# EAGLE schematic CNC Power V2 (EAGLE 7.6.0)
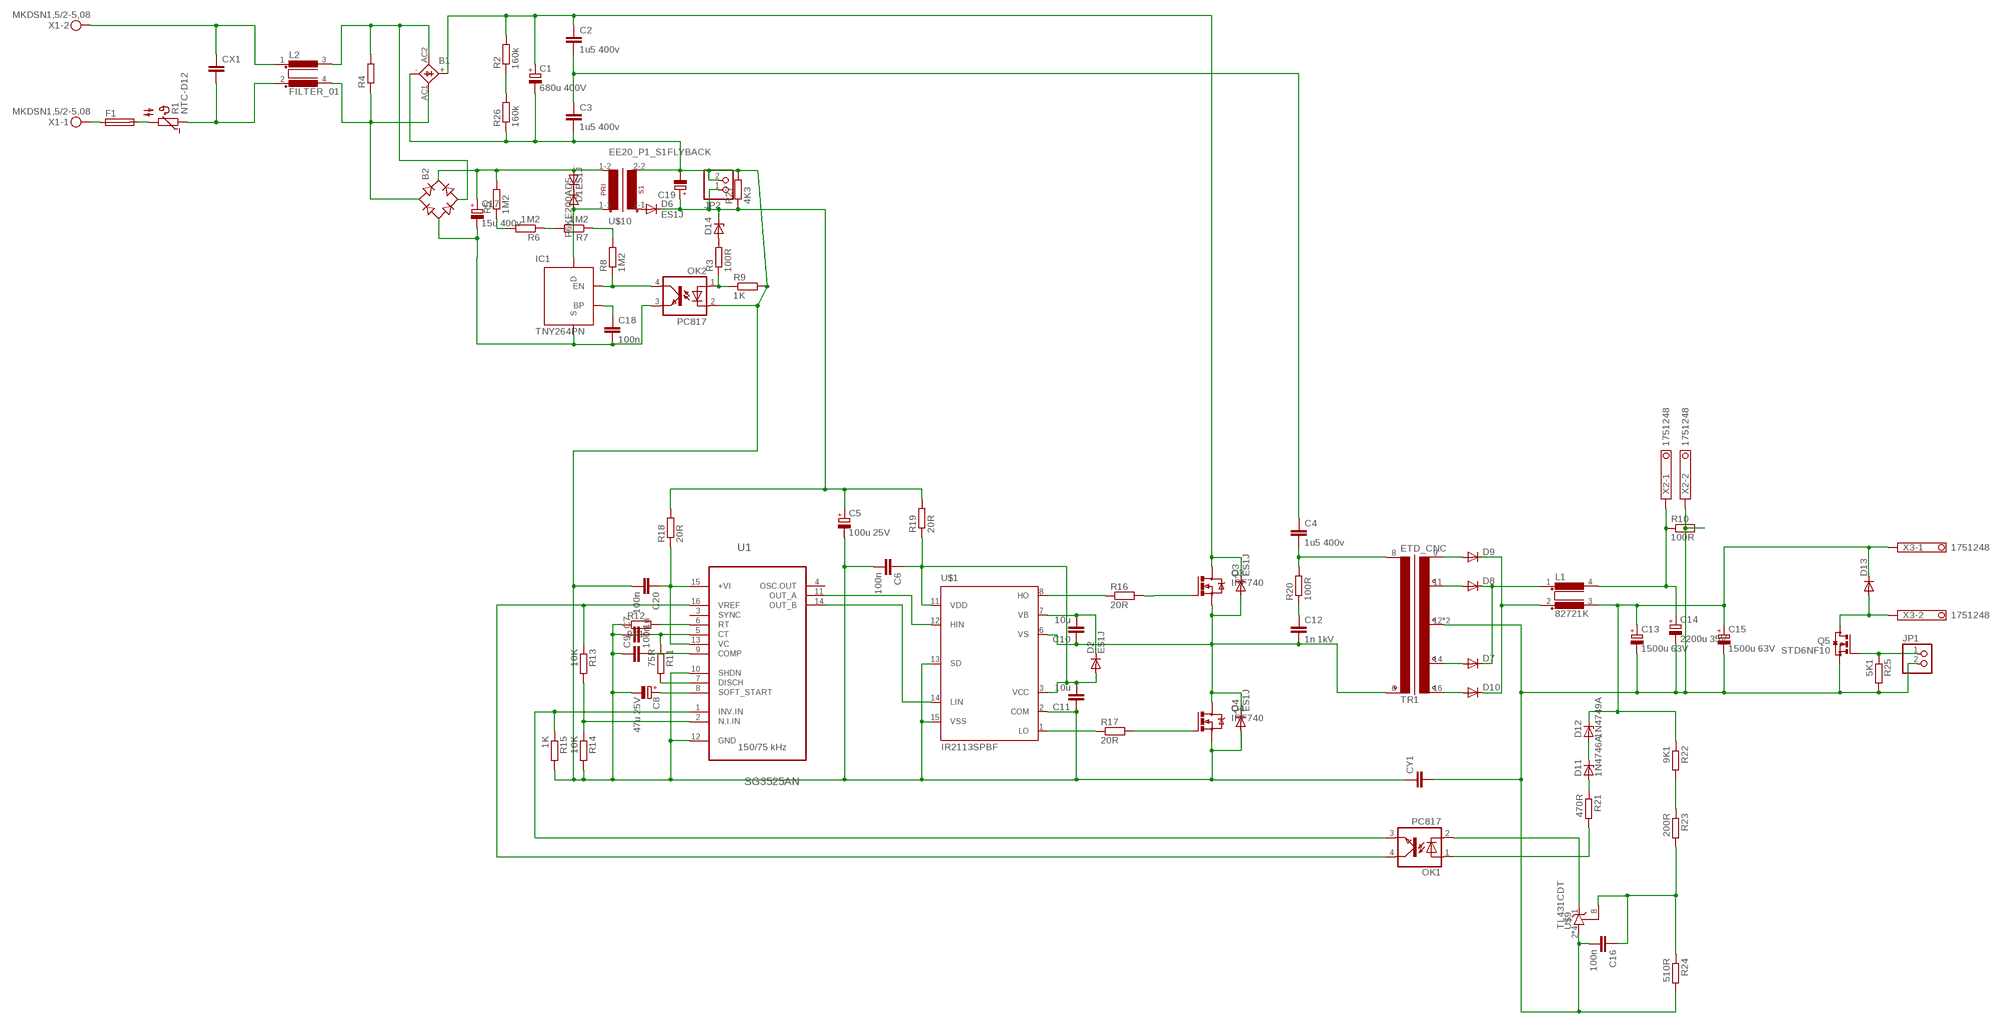
[diagram p0: schematic, sheet 1]

## Parts
B1  KBL  [KBL]
B2  RB1A  [RB1A]
C1  680u 400V  CPOL-EUE10-35  [EB35D]
C2  1u5 400v  C-EU225-074X268  [C225-074X268]
C3  1u5 400v  C-EU225-074X268  [C225-074X268]
C4  1u5 400v  C-EU225-074X268  [C225-074X268]
C5  100u 25V  CPOL-EUE2.5-7  [E2,5-7]
C6  100n  C-EUC0805  [C0805]
C7  1n  C-EUC0805  [C0805]
C8  47u 25V  CPOL-EUE2.5-7  [E2,5-7]
C9  100n  C-EUC0805  [C0805]
C10  10u  C-EUC0805  [C0805]
C11  10u  C-EUC0805  [C0805]
C12  1n 1kV  C-EU050-025X075  [C050-025X075]
C13  1500u 63V  CPOL-EUE7.5-18  [E7,5-18]
C14  2200u 35V  CPOL-EUE7.5-18  [E7,5-18]
C15  1500u 63V  CPOL-EUE7.5-18  [E7,5-18]
C16  100n  C-EUC0805  [C0805]
C17  15u 400v  CPOL-EUE5-13  [E5-13]
C18  100n  C-EUC0805  [C0805]
C19  CPOL-EUE2.5-7  [E2,5-7]
C20  100n  C-EUC0805  [C0805]
CX1  CXXC15B8  [XC15B8]
CY1  CYYC10B4  [YC10B4]
D1  P6KE200A  DIODE-DO204-10  [DO204-10]
D2  ES1J  DIODE-DO214AC  [DO214AC]
D3  ES1J  DIODE-DO214AC  [DO214AC]
D4  ES1J  DIODE-DO214AC  [DO214AC]
D5  ES1J  DIODE-DO214AC  [DO214AC]
D6  ES1J  DIODE-DO214AC  [DO214AC]
D7  DIODE-DO220S  [DO220S]
D8  DIODE-DO220S  [DO220S]
D9  DIODE-DO220S  [DO220S]
D10  DIODE-DO220S  [DO220S]
D11  1N4746A  ZENER-DIODEDO41Z10  [DO41Z10]
D12  1N4749A  ZENER-DIODEDO41Z10  [DO41Z10]
D13  DIODE-DO220S  [DO220S]
D14  ZENER-DIODEDO41Z10  [DO41Z10]
F1  SH22,5  [SH22,5]
IC1  TNY264PN  [DIP-8B]
JP1  PINHD-1X2  [1X02]
JP2  PINHD-1X2  [1X02]
L1  82721K  [82721K]
L2  FILTER_01  [82721K]
OK1  PC817  [DIL04]
OK2  PC817  [DIL04]
Q3  IRF740  [TO220BV]
Q4  IRF740  [TO220BV]
Q5  STD6NF10  [DPAK]
R1  NTC-D12  [NTC-D12]
R2  160k  R-EU_0207/10  [0207/10]
R3  100R  R-EU_R0805  [R0805]
R4  R-EU_0309/10  [0309/10]
R5  1M2  R-EU_R0805  [R0805]
R6  1M2  R-EU_R0805  [R0805]
R7  1M2  R-EU_R0805  [R0805]
R8  1M2  R-EU_R0805  [R0805]
R9  1K  R-EU_R0805  [R0805]
R10  100R  R_SQP-5  [SQP-5]
R11  75R  R-EU_R0805  [R0805]
R12  9K1  R-EU_R0805  [R0805]
R13  10K  R-EU_R0805  [R0805]
R14  10K  R-EU_R0805  [R0805]
R15  1K  R-EU_R0805  [R0805]
R16  20R  R-EU_0309/12  [0309/12]
R17  20R  R-EU_0309/12  [0309/12]
R18  20R  R-EU_R2512  [R2512]
R19  20R  R-EU_R2512  [R2512]
R20  100R  R-EU_0617/17  [0617/17]
R21  470R  R-EU_R0805  [R0805]
R22  9K1  R-EU_R0805  [R0805]
R23  200R  R-EU_R0805  [R0805]
R24  510R  R-EU_R0805  [R0805]
R25  5K1  R-EU_R0805  [R0805]
R26  160k  R-EU_0207/10  [0207/10]
R27  4K3  R-EU_R0805  [R0805]
TR1  ETD_CNC  [ETD39_16PIN]
U1  SG3525AN  [DIP254P762X510-16]
U$1  IR2113SPBF  [SO16W]
U$9  TL431CDT  [SO8]
U$10  EE20_P1_S1FLYBACK  [EE20_P1_S1-REV-4PIN]
X1  MKDSN1,5/2-5,08  [MKDSN1,5/2-5,08]
X2  1751248  [1751248]
X3  1751248  [1751248]

## Nets
HV-0: B1.- C1.- C3.2 C5.- C6.2 C7.1 C8.- C9.1 C11.1 C19.- C20.2 CY1.1 D4.A JP2.2 OK2.2(C) Q4.S R9.2 R12.1 R14.2 R15.2 R26.1 R27.2 U1.10(SHDN) U1.12(GND) U$1.2(COM) U$1.13(SD) U$1.15(VSS) U$10.2-2(S1-2)
HV-150: C2.2 C3.1 C4.1
HV-300: B1.+ C1.+ C2.1 D3.C Q3.D R2.2
N$1: F1.1 X1.1
N$2: F1.2 R1.2
N$3: CX1.2 L2.2 R1.1
N$4: D7.A TR1.14(S2-1)
N$5: R16.1 U$1.8(HO)
N$6: R17.1 U$1.1(LO)
N$7: Q3.G R16.2
N$8: OK1.3(EMIT) R15.1 U1.1(INV.IN)
N$9: C4.2 R20.2 TR1.8(P1-2)
N$10: C20.1 R18.1 U1.13(VC) U1.15(+VI)
N$11: B1.AC1(AC2) B2.AC1 L2.4 R4.1
N$12: CX1.1 L2.1 X1.2
N$13: B2.- C17.- C18.2 IC1.2(S) IC1.3(S) IC1.7(S) IC1.8(S) OK2.3(EMIT)
N$14: B1.AC2(AC1) B2.AC2 L2.3 R4.2
N$15: C7.2 R11.1 U1.5(CT)
N$16: R11.2 U1.7(DISCH)
N$17: Q4.G R17.2
N$18: U1.11(OUT_A) U$1.12(HIN)
N$19: U1.14(OUT_B) U$1.14(LIN)
N$20: R12.2 U1.6(RT)
N$21: C8.+ U1.8(SOFT_START)
N$22: C9.2 U1.9(COMP)
N$23: OK1.4(COL) R13.1 U1.16(VREF)
N$24: R13.2 R14.1 U1.2(N.I.IN)
N$25: IC1.4(EN) OK2.4(COL) R8.1
N$26: D10.A TR1.16(S1-1)
N$27: D8.A TR1.11(S2-2)
N$28: R5.1 R6.2
N$29: R6.1 R7.2
N$30: C12.1 R20.1
N$31: D9.A TR1.9(S1-2)
N$32: D7.C D8.C L1.1
N$33: D9.C D10.C L1.2
N$34: C13.- C14.- C15.- C16.2 CY1.2 JP1.2 Q5.S R10.2 R24.2 R25.2 TR1.12(S0) TR1.13(S0) U$9.2(A) U$9.3(A) U$9.6(A) U$9.7(A) X2.2
N$35: C14.+ L1.4 R10.1 X2.1
N$36: C13.+ C15.+ D12.C D13.C L1.3 R22.1 X3.1
N$37: D11.C D12.A
N$38: D11.A R21.1
N$39: OK1.1(A) R21.2
N$40: OK1.2(C) U$9.1(C)
N$41: C16.1 R23.2 R24.1 U$9.8(R)
N$42: R22.2 R23.1
N$43: JP1.1 Q5.G R25.1
N$44: R2.1 R26.2
N$45: D13.A Q5.D X3.2
N$46: C5.+ C19.+ D6.C D14.C JP2.1 R18.2 R19.2 R27.1
N$47: R7.1 R8.2
N$48: D1.C D5.C
N$49: D5.A IC1.5(D) U$10.1-1
N$50: D14.A R3.2
N$51: C18.1 IC1.1(BP)
N$52: B2.+ C17.+ D1.A R5.2 U$10.1-2
N$53: D6.A U$10.2-1(S1-1)
N$54: OK2.1(A) R3.1 R9.1
VB: C10.2 D2.C U$1.7(VB)
VCC: C6.1 C11.2 D2.A R19.1 U$1.3(VCC) U$1.11(VDD)
VS: C10.1 C12.2 D3.A D4.C Q3.S Q4.D TR1.6(P1-1) U$1.6(VS)
Unconnected: U1.3(SYNC) U1.4(OSC.OUT)

## Notes on the sheet
- 150/75 kHz

## Library data of the parts
B1 = rectifier:KBL: DIOTEC RECTIFIER
B2 = rectifier:RB1A: RECTIFIER 1 A
C1 C5 C8 C13-C15 C17 C19 = rcl:CPOL-EU: POLARIZED CAPACITOR, European symbol
C2-C4 C6 C7 C9-C12 C16 C18 C20 = rcl:C-EU: CAPACITOR, European symbol
CX1 = rcl:CX: X CAPACITOR for power line
CY1 = rcl:CY: Y CAPACITOR for power line
D1-D10 D13 = diode:DIODE-: DIODE
D11 D12 D14 = diode:ZENER-DIODE: Z-Diode
F1 = fuse:SH22,5: FUSE HOLDER grid 22,5 mm, OGN0031 8201, Schurter (Buerklin); MF: SCHURTER; MPN: 0031.8201; OC_FARNELL: 1162740; OC_NEWARK: 96F8317
IC1 = Namenlos:TNY264PN
JP1 JP2 = pinhead:PINHD-1X2: PIN HEADER
L1 = _Transformers:82721K: FILTER
L2 = _Transformers:FILTER_01
OK1 OK2 = optocoupler:PC817: SHARP OPTO COUPLER; MPN: PC817X4J000F; OC_FARNELL: 9707727; OC_NEWARK: 97K7059
Q3 Q4 = transistor-power:IRF740: N-CHANNEL MOS FET
Q5 = Namenlos:STD6NF10
R1 = Namenlos:NTC-D12
R2-R9 R11-R27 = rcl:R-EU_: RESISTOR, European symbol
R10 = Namenlos:R_SQP-5
TR1 = _Transformers:ETD_CNC
U1 = ST Microelctronics_By_element14_Batch_1:SG3525AN: REGULATING PULSE WIDTH MODULATORS; MPN: SG3525AN; OC_FARNELL: 1564368; OC_NEWARK: 89K1506; PACKAGE: PDIP-16; SUPPLIER: STMICROELECTRONICS
U$1 = Namenlos:IR2113SPBF
U$9 = Namenlos:TL431
U$10 = _Transformers:EE20_P1_S1
X1 = con-phoenix-508:MKDSN1,5/2-5,08: MKDSN 1,5/ 2-5,08 Printklemme Nennstrom: 13,5 A Nennspannung: 250 V Rastermaß: 5,08 mm Polzahl: 2 Anschlussart: Schraubanschluss Montage: Löten Anschlussrichtung Leiter/Platine: 0 ° Artikelnummer: 1729128 Source: http://eshop.phoenixcontact.com .. 1729128.pdf
X2 X3 = con-phoenix-350:1751248: MKDS 1/ 2-3,5 Printklemme Nennstrom: 10 A Bemessungsspannung: 160 V Raster: 3,5 mm Polzahl: 2 Montageart: Löten Anschlussart: Schraubanschluss Anschlussrichtung vom Leiter zur Platine: 0° Source: http://eshop.phoenixcontact.com .. 1751248.pdf; OC_FARNELL: unknown; OC_NEWARK: unknown

## Net classes
0 default: clearance 0.205 mm